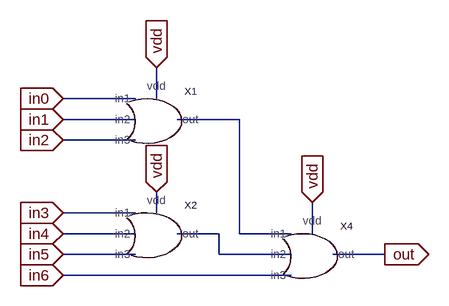
[diagram p0: schematic or7.asc]
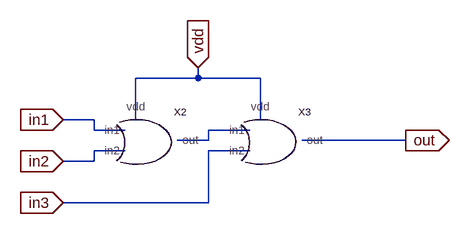
[diagram p1: sub-circuit or3.asc]
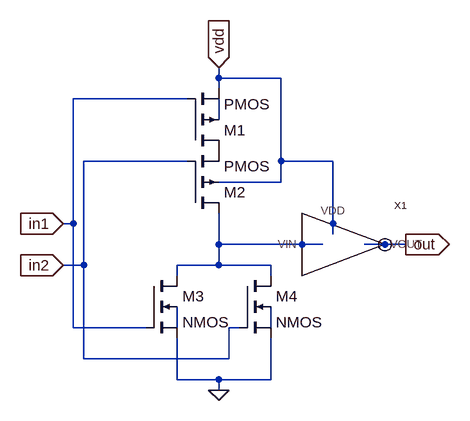
[diagram p2: sub-circuit or.asc]
or7.asc, the LTspice schematic file:
Version 4
SHEET 1 880 680
WIRE 224 64 112 64
WIRE 256 64 256 16
WIRE 224 96 112 96
WIRE 384 96 288 96
WIRE 224 128 112 128
WIRE 224 240 112 240
WIRE 256 240 256 208
WIRE 224 272 112 272
WIRE 352 272 288 272
WIRE 384 272 384 96
WIRE 464 272 384 272
WIRE 496 272 496 224
WIRE 224 304 112 304
WIRE 352 304 352 272
WIRE 464 304 352 304
WIRE 608 304 528 304
WIRE 464 336 112 336
FLAG 608 304 out
IOPIN 608 304 Out
FLAG 256 16 vdd
IOPIN 256 16 In
FLAG 256 208 vdd
IOPIN 256 208 In
FLAG 496 224 vdd
IOPIN 496 224 In
FLAG 112 64 in0
IOPIN 112 64 In
FLAG 112 96 in1
IOPIN 112 96 In
FLAG 112 128 in2
IOPIN 112 128 In
FLAG 112 240 in3
IOPIN 112 240 In
FLAG 112 272 in4
IOPIN 112 272 In
FLAG 112 304 in5
IOPIN 112 304 In
FLAG 112 336 in6
IOPIN 112 336 In
SYMBOL or3 240 96 R0
SYMATTR InstName X1
SYMBOL or3 240 272 R0
SYMATTR InstName X2
SYMBOL or3 480 304 R0
SYMATTR InstName X4

or3.asc, the sub-circuit schematic file:
Version 4
SHEET 1 880 680
WIRE 256 32 256 16
WIRE 256 32 160 32
WIRE 352 32 256 32
WIRE 96 96 48 96
WIRE 160 96 160 32
WIRE 352 96 352 32
WIRE 96 112 96 96
WIRE 144 112 96 112
WIRE 336 112 272 112
WIRE 272 128 272 112
WIRE 272 128 224 128
WIRE 576 128 416 128
WIRE 144 144 96 144
WIRE 336 144 272 144
WIRE 96 160 96 144
WIRE 96 160 48 160
WIRE 272 224 272 144
WIRE 272 224 48 224
FLAG 48 96 in1
IOPIN 48 96 In
FLAG 48 160 in2
IOPIN 48 160 In
FLAG 576 128 out
IOPIN 576 128 Out
FLAG 256 16 vdd
IOPIN 256 16 In
FLAG 48 224 in3
IOPIN 48 224 In
SYMBOL or 160 128 R0
SYMATTR InstName X2
SYMBOL or 352 128 R0
SYMATTR InstName X3

or.asc, the sub-circuit schematic file:
Version 4
SHEET 1 880 680
WIRE 288 -128 288 -144
WIRE 384 -128 288 -128
WIRE 288 -112 288 -128
WIRE 240 -96 64 -96
WIRE 288 -64 288 -96
WIRE 240 0 80 0
WIRE 384 0 384 -128
WIRE 464 0 384 0
WIRE 384 32 384 0
WIRE 384 32 288 32
WIRE 64 96 64 -96
WIRE 64 96 48 96
WIRE 464 112 464 0
WIRE 288 128 288 80
WIRE 448 128 288 128
WIRE 576 128 512 128
WIRE 80 160 80 0
WIRE 80 160 48 160
WIRE 288 160 288 128
WIRE 288 160 224 160
WIRE 368 160 288 160
WIRE 224 176 224 160
WIRE 368 176 368 160
WIRE 64 256 64 96
WIRE 176 256 64 256
WIRE 224 256 224 224
WIRE 320 256 304 256
WIRE 368 256 368 224
WIRE 80 304 80 160
WIRE 304 304 304 256
WIRE 304 304 80 304
WIRE 224 336 224 272
WIRE 288 336 224 336
WIRE 368 336 368 272
WIRE 368 336 288 336
WIRE 288 352 288 336
FLAG 48 96 in1
IOPIN 48 96 In
FLAG 48 160 in2
IOPIN 48 160 In
FLAG 576 128 out
IOPIN 576 128 Out
FLAG 288 -144 vdd
IOPIN 288 -144 In
FLAG 288 352 0
SYMBOL pmos4 240 -16 M180
SYMATTR InstName M1
SYMATTR Value2 l=90n w=400n
SYMBOL pmos4 240 80 M180
SYMATTR InstName M2
SYMATTR Value2 l=90n w=400n
SYMBOL nmos4 176 176 R0
SYMATTR InstName M3
SYMATTR Value2 l=90n w=200n
SYMBOL nmos4 320 176 R0
SYMATTR InstName M4
SYMATTR Value2 l=90n w=200n
SYMBOL inverter 464 128 R0
SYMATTR InstName X1

The netlist it stands for:
* or7.asc
XX1 in0 in1 vdd N001 in2 or3
XX2 in3 in4 vdd N002 in5 or3
XX4 N001 N002 vdd out in6 or3

* block symbol definitions
.subckt or3 in1 in2 vdd out in3
XX2 in1 in2 vdd N001 or
XX3 N001 in3 vdd out or
.ends or3

.subckt or in1 in2 vdd out
M1 P001 in1 vdd N001 PMOS l=90n w=400n
M2 N002 in2 P001 vdd PMOS l=90n w=400n
M3 N002 in1 0 N003 NMOS l=90n w=200n
M4 N002 in2 0 N004 NMOS l=90n w=200n
XX1 vdd out N002 inverter  ; pins VDD VOUT VIN
.ends or

.model NMOS NMOS
.model PMOS PMOS
.lib standard.mos
.backanno
.end